# EAGLE design AQILITY (EAGLE 7.1.0)
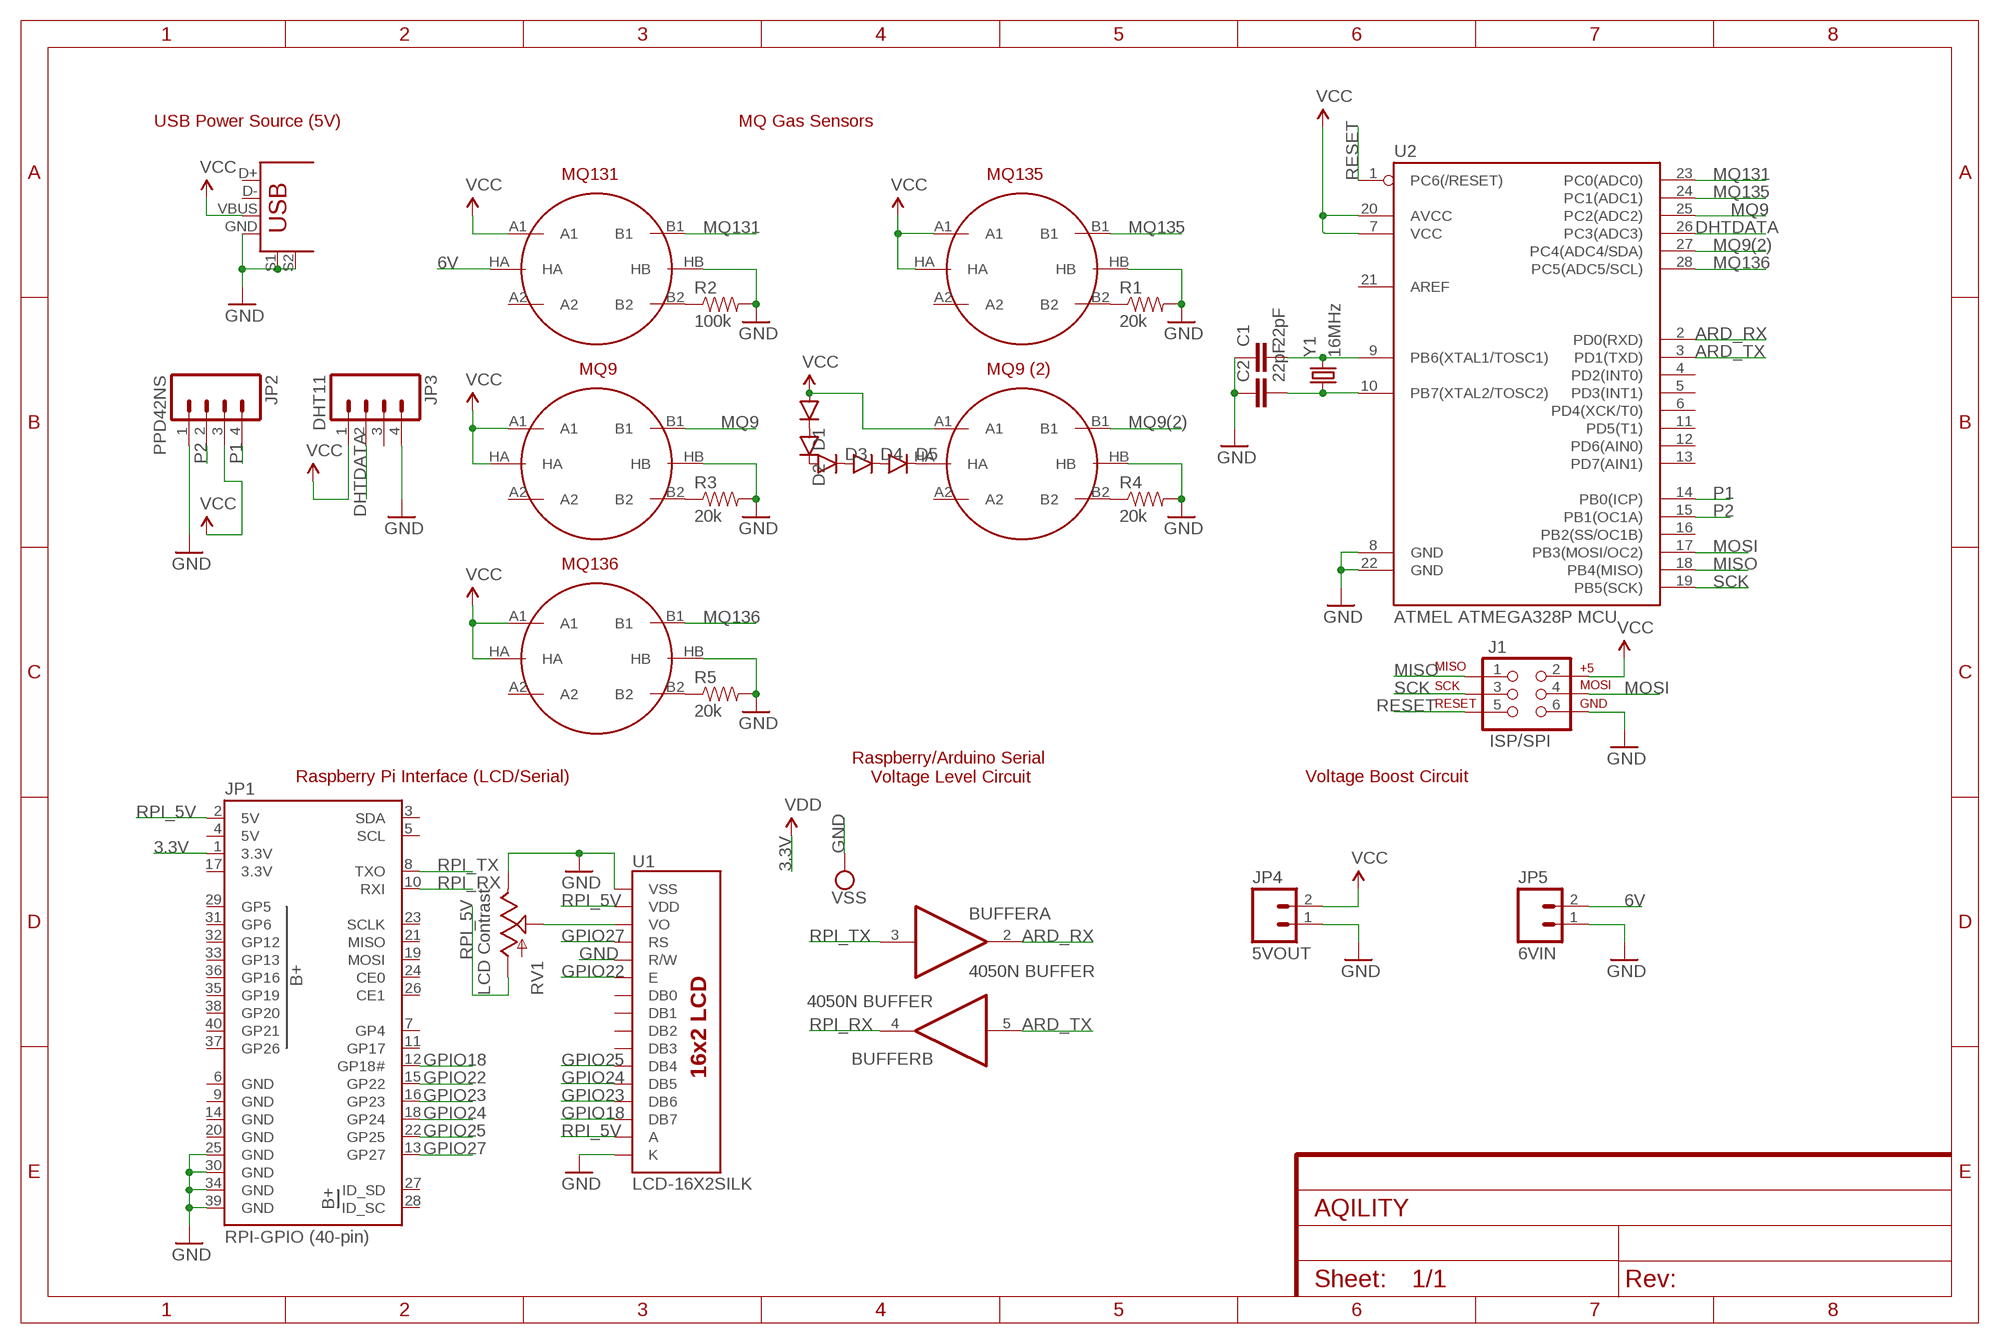
[diagram p0: schematic, sheet 1]

## Parts
BUFFER  4050N BUFFER  4050N  [DIL16]
C1  22pF  CAPEZ  [CAP-PTH-SMALLEZ]
C2  22pF  CAPEZ  [CAP-PTH-SMALLEZ]
D1  DIODEKIT2  [DIODE-1N4001-KIT]
D2  DIODEKIT2  [DIODE-1N4001-KIT]
D3  DIODEKIT2  [DIODE-1N4001-KIT]
D4  DIODEKIT2  [DIODE-1N4001-KIT]
D5  DIODEKIT2  [DIODE-1N4001-KIT]
J1  ISP/SPI  AVR_SPI_PRG_6PTH  [2X3]
JP1  RPI-GPIO (40-pin)  RASPBERRYPI-B+-GPIO  [2X20-SHROUDED]
JP2  PPD42NS  M04PTH  [1X04]
JP3  DHT11  M04PTH  [1X04]
JP4  5VOUT  M02PTH  [1X02]
JP5  6VIN  M02PTH  [1X02]
MQ9  METHANE_SENSOR  [MQ-3]
MQ9(2)  METHANE_SENSOR  [MQ-3]
MQ131  METHANE_SENSOR  [MQ-3]
MQ135  METHANE_SENSOR  [MQ-3]
MQ136  METHANE_SENSOR  [MQ-3]
R1  20k  RESISTORPTH-1/4W  [AXIAL-0.4]
R2  100k  RESISTORPTH-1/4W  [AXIAL-0.4]
R3  20k  RESISTORPTH-1/4W  [AXIAL-0.4]
R4  20k  RESISTORPTH-1/4W  [AXIAL-0.4]
R5  20k  RESISTORPTH-1/4W  [AXIAL-0.4]
RV1  LCD Contrast  POT100K_3362U  [3362U]
U1  LCD-16X2SILK  [LCD-16X2]
U2  ATMEL ATMEGA328P MCU  ATMEGA328P_PDIP  [DIL28-3]
U$5  USB/5V  USB+SHIELD  [USB-B-PTH]
Y1  16MHz  CRYSTALHC49UV  [HC49U-V]

## Nets
3.3V: JP1.1(3.3V) ; supply symbol labelled VDD
6V: JP5.2 MQ131.HA
ARD_RX: BUFFER.2(A:O) U2.2(PD0(RXD))
ARD_TX: BUFFER.5(B:I) U2.3(PD1(TXD))
DHTDATA: JP3.2 U2.26(PC3(ADC3))
GND: C1.1 C2.1 J1.6 JP1.25(GND) JP1.30(GND) JP1.34(GND) JP1.39(GND) JP2.1 JP3.4 JP4.1 JP5.1 MQ9(2).HB MQ9.HB MQ131.HB MQ135.HB MQ136.HB R1.P$2 R2.P$2 R3.P$2 R4.P$2 R5.P$2 RV1.P$1(E) U1.1(VSS) U1.5(R/W) U1.16(K) U2.8(GND) U2.22(GND) U$5.GND U$5.S1 U$5.S2 ; supply symbol labelled VSS
GPIO18: JP1.12(GP18#) U1.14(DB7)
GPIO22: JP1.15(GP22) U1.6(E)
GPIO23: JP1.16(GP23) U1.13(DB6)
GPIO24: JP1.18(GP24) U1.12(DB5)
GPIO25: JP1.22(GP25) U1.11(DB4)
GPIO27: JP1.13(GP27) U1.4(RS)
MISO: J1.1 U2.18(PB4(MISO))
MOSI: J1.4 U2.17(PB3(MOSI/OC2))
MQ9: MQ9.B1 U2.25(PC2(ADC2))
MQ9(2): MQ9(2).B1 U2.27(PC4(ADC4/SDA))
MQ131: MQ131.B1 U2.23(PC0(ADC0))
MQ135: MQ135.B1 U2.24(PC1(ADC1))
MQ136: MQ136.B1 U2.28(PC5(ADC5/SCL))
N$1: RV1.P$2(S) U1.3(VO)
N$2: C1.2 U2.9(PB6(XTAL1/TOSC1)) Y1.2
N$3: C2.2 U2.10(PB7(XTAL2/TOSC2)) Y1.1
N$4: D1.C D2.A
N$5: D2.C D3.A
N$6: D3.C D4.A
N$7: D5.C MQ9(2).HA
N$8: D4.C D5.A
N$9: MQ136.B2 R5.P$1
N$10: MQ135.B2 R1.P$1
N$11: MQ9.B2 R3.P$1
N$14: MQ131.B2 R2.P$1
N$15: MQ9(2).B2 R4.P$1
P1: JP2.4 U2.14(PB0(ICP))
P2: JP2.2 U2.15(PB1(OC1A))
RESET: J1.5 U2.1(PC6(/RESET))
RPI_5V: JP1.2(5V) RV1.P$3(A) U1.2(VDD) U1.15(A)
RPI_RX: BUFFER.4(B:O) JP1.10(RXI)
RPI_TX: BUFFER.3(A:I) JP1.8(TXO)
SCK: J1.3 U2.19(PB5(SCK))
VCC: D1.A J1.2 JP2.3 JP3.1 JP4.2 MQ9(2).A1 MQ9.A1 MQ9.HA MQ131.A1 MQ135.A1 MQ135.HA MQ136.A1 MQ136.HA U2.7(VCC) U2.20(AVCC) U$5.VBUS
Unconnected: BUFFER.6(C:O) BUFFER.7(C:I) BUFFER.9(D:I) BUFFER.10(D:O) BUFFER.11(E:I) BUFFER.12(E:O) BUFFER.14(F:I) BUFFER.15(F:O) JP1.3(SDA) JP1.5(SCL) JP1.7(GP4) JP1.11(GP17) JP1.19(MOSI) JP1.21(MISO) JP1.23(SCLK) JP1.24(CE0) JP1.26(CE1) JP1.27(ID_SD) JP1.28(ID_SC) JP1.29(GP5) JP1.31(GP6) JP1.32(GP12) JP1.33(GP13) JP1.35(GP19) JP1.36(GP16) JP1.37(GP26) JP1.38(GP20) JP1.40(GP21) JP3.3 MQ9(2).A2 MQ9.A2 MQ131.A2 MQ135.A2 MQ136.A2 U1.7(DB0) U1.8(DB1) U1.9(DB2) U1.10(DB3) U2.4(PD2(INT0)) U2.5(PD3(INT1)) U2.6(PD4(XCK/T0)) U2.11(PD5(T1)) U2.12(PD6(AIN0)) U2.13(PD7(AIN1)) U2.16(PB2(SS/OC1B)) U2.21(AREF) U$5.D+ U$5.D-

## Notes on the sheet
- USB Power Source (5V) | MQ Gas Sensors
- MQ131 | MQ135
- MQ9 | MQ9 (2)
- MQ136
- Raspberry Pi Interface (LCD/Serial)
- Raspberry/Arduino Serial 
  Voltage Level Circuit
- Voltage Boost Circuit

## Power pins joined to a net without a drawn wire
3.3V: BUFFER.1(P:VDD) JP1.17(3.3V)
5V: JP1.4(5V)
GND: BUFFER.8(P:VSS) JP1.6(GND) JP1.9(GND) JP1.14(GND) JP1.20(GND)

## Library data of the parts
BUFFER = 40xx:4050: Hex non-inverting BUFFER
C1 C2 = SparkFun-Capacitors:CAP: Capacitor Standard 0603 ceramic capacitor, and 0.1" leaded capacitor.
D1-D5 = SparkFun-DiscreteSemi:DIODE: Diode These are standard reverse protection diodes and small signal diodes. SMA package can handle up to about 1A. SOD-323 can handle about 200mA. What the SOD-323 package when ordering, there are some mfgs out there that are 5-pin packages.
J1 = SparkFun-Connectors:AVR_SPI_PRG_6: AVR ISP 6 Pin This is the reduced ISP connector for AVR programming. Common on Arduino. This footprint will take up less PCB space and can be used with a 10-pin to 6-pin adapter such as SKU: BOB-08508 **Special note about "TEST_POINT" package. The stop mask is on the top side, so if you want your programming test points to be on the bottom of your board, make sure to place this package on the bottom side of the board. This also ensure that the orientation to program from the bottom side will be correct.
JP1 = SparkFun-Boards:RASPBERRYPI-B+-GPIO: Raspberry Pi B+ GPIO Header 2x20 pin connector
JP2 JP3 = SparkFun-Connectors:M04: Header 4 Standard 4-pin 0.1" header. Use with straight break away headers (SKU : PRT-00116), right angle break away headers (PRT-00553), swiss pins (PRT-00743), machine pins (PRT-00117), and female headers (PRT-00115). Molex polarized connector foot print use with SKU : PRT-08231 with associated crimp pins and housings. 1MM SMD Version SKU: PRT-10208
JP4 JP5 = SparkFun-Connectors:M02: Standard 2-pin 0.1" header. Use with - straight break away headers ( PRT-00116) - right angle break away headers (PRT-00553) - swiss pins (PRT-00743) - machine pins (PRT-00117) - female headers (PRT-00115) Molex polarized connector foot print use with: PRT-08233 with associated crimp pins and housings. 2.54_SCREWTERM for use with PRT-10571. 3.5mm Screw Terminal footprints for PRT-08084 5mm Screw Terminal footprints for use with PRT-08432
MQ9 MQ9(2) MQ131 MQ135 MQ136 = SparkFun-Sensors:METHANE_SENSOR: MQ-4 Methane Gas Sensor SEN-09404
R1-R5 = SparkFun-Passives:RESISTOR: Resistor Basic schematic elements and footprints for 0603, 1206, and PTH resistors.
RV1 = SparkFun-Electromechanical:POT
U1 = SparkFun-Displays:LCD-16X2: Standard text-only 16x2 parallel input LCD
U2 = SparkFun-DigitalIC:ATMEGA328P_PDIP: uC used in the Arduino 32kb flash, 1k EEPROM, 2k SRAM This is the through-hole version of this chip.
U$5 = SparkFun-Connectors:USB+SHIELD: USB+Shield USB connector with shield pins connectable
Y1 = SparkFun-FreqCtrl:CRYSTAL: Various standard crystals. Proven footprints.

## Board
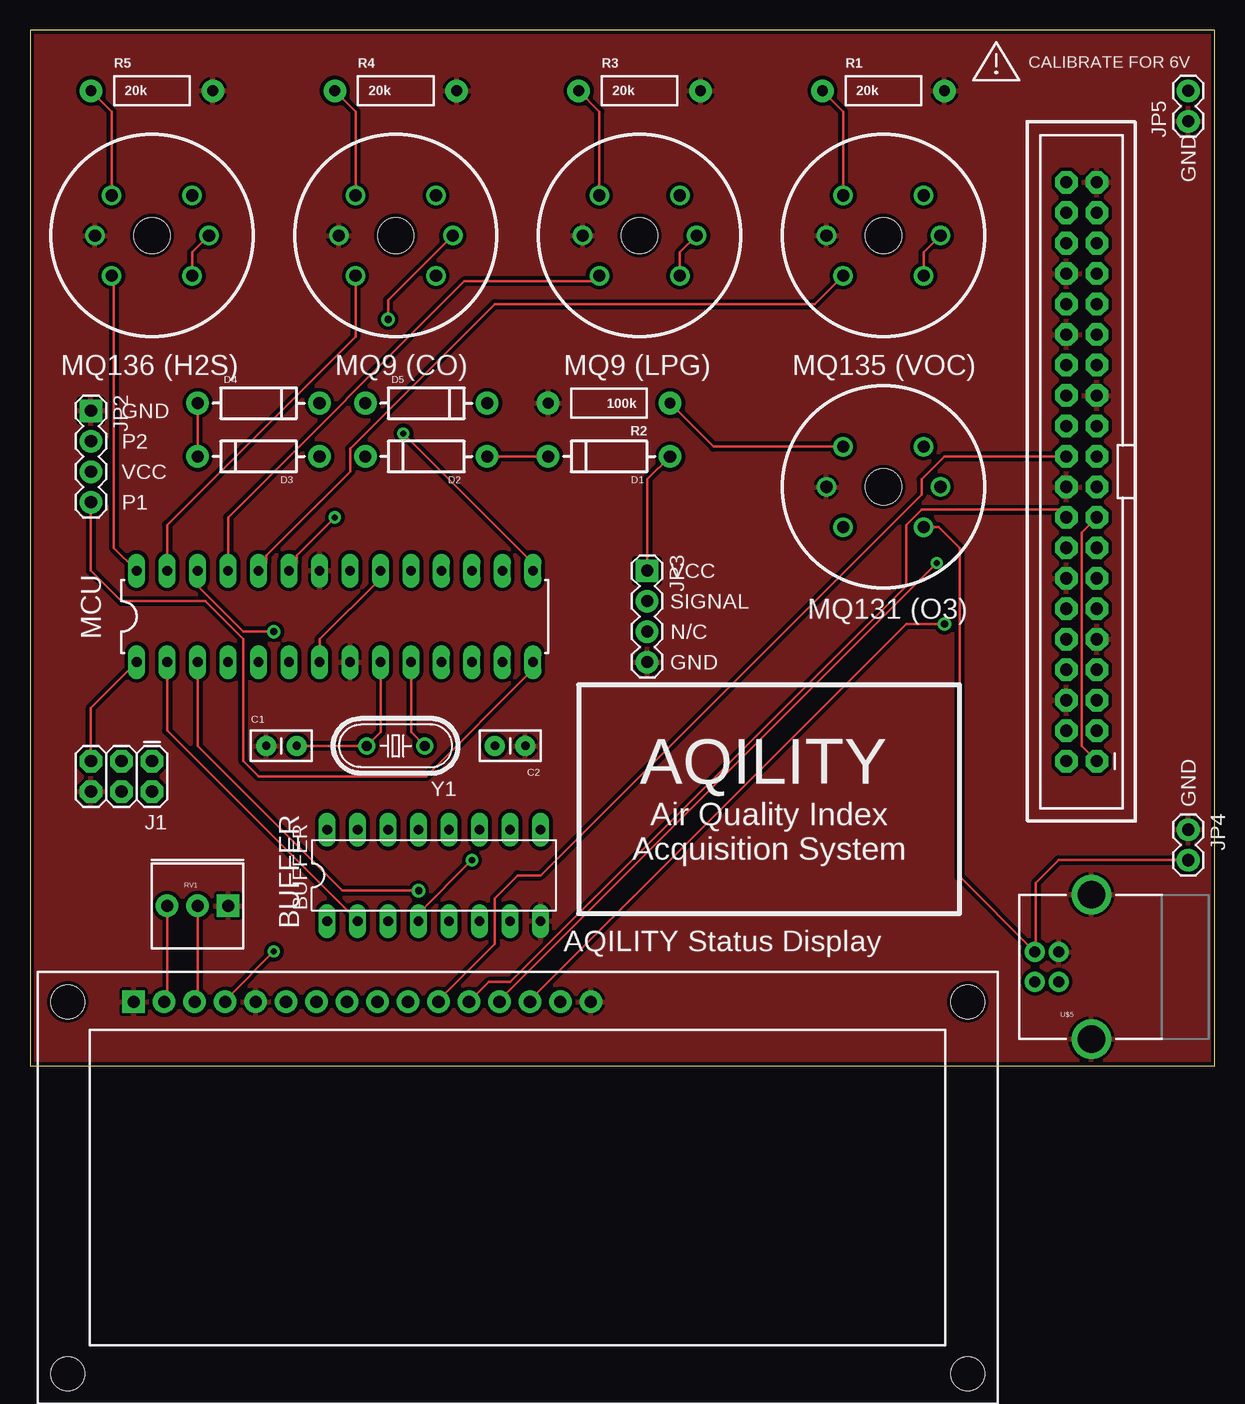
[diagram p1: board, top side]
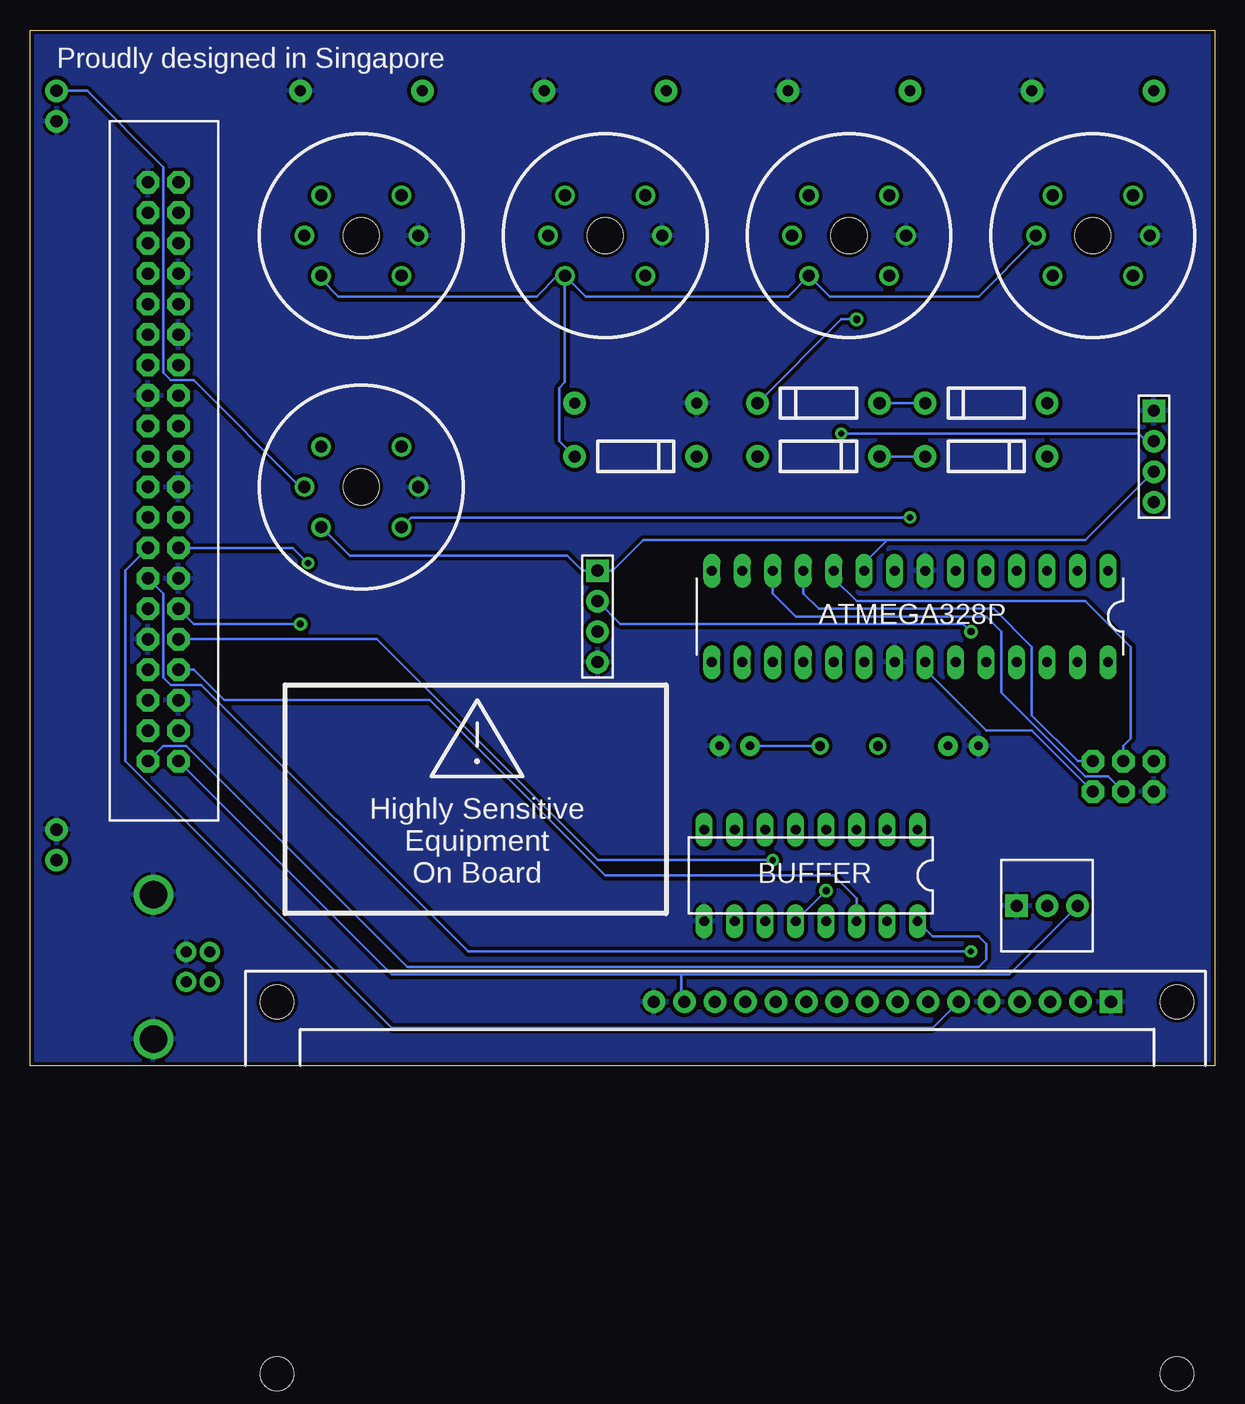
[diagram p2: board, bottom side, seen from below]

Size 98.73 x 86.35 mm. Coordinates in mm from the lower left corner, seen from the top.
Outline: 0,0 98.73,0 98.73,86.35 0,86.35 0,0
Copper layers (1*16): Top 0.035mm / dielectric 1.5mm / Bottom 0.035mm
Design rules "SparkFun": minimum track width 8mil, minimum drill 20mil, track to track 8mil, track to pad 8mil, pad to pad 8mil, via to via 8mil, smd to smd 8mil, copper to edge 10mil, drill to drill 8mil, minimum pad ring 12mil, minimum via ring 10mil, stop-mask expansion 4mil, vias tented up to drill 25mil, thermal gap 10mil

### Footprints (pad centres in the part's own frame; a part is rotated, then mirrored left to right if it is on the bottom)
DIL16 = drill 0.813 long: 1 -8.89,-3.81; 2 -6.35,-3.81; 3 -3.81,-3.81; 4 -1.27,-3.81; 5 1.27,-3.81; 6 3.81,-3.81; 7 6.35,-3.81; 8 8.89,-3.81; 9 8.89,3.81; 10 6.35,3.81; 11 3.81,3.81; 12 1.27,3.81; 13 -1.27,3.81; 14 -3.81,3.81; 15 -6.35,3.81; 16 -8.89,3.81
CAP-PTH-SMALLEZ = drill 0.7 pad 1.651: 1 0,0; 2 2.54,0
DIODE-1N4001-KIT = drill 1.016 pad 1.88: A -5.08,0; C 5.08,0
2X3 = drill 1.016 pad 1.88 octagon: 1 0,0; 2 0,2.54; 3 2.54,0; 4 2.54,2.54; 5 5.08,0; 6 5.08,2.54
2X20-SHROUDED = drill 1.016 pad 1.88 octagon: 1 -1.27,24.13; 2 1.27,24.13; 3 -1.27,21.59; 4 1.27,21.59; 5 -1.27,19.05; 6 1.27,19.05; 7 -1.27,16.51; 8 1.27,16.51; 9 -1.27,13.97; 10 1.27,13.97; 11 -1.27,11.43; 12 1.27,11.43; 13 -1.27,8.89; 14 1.27,8.89; 15 -1.27,6.35; 16 1.27,6.35; 17 -1.27,3.81; 18 1.27,3.81; 19 -1.27,1.27; 20 1.27,1.27; 21 -1.27,-1.27; 22 1.27,-1.27; 23 -1.27,-3.81; 24 1.27,-3.81; 25 -1.27,-6.35; 26 1.27,-6.35; 27 -1.27,-8.89; 28 1.27,-8.89; 29 -1.27,-11.43; 30 1.27,-11.43; 31 -1.27,-13.97; 32 1.27,-13.97; 33 -1.27,-16.51; 34 1.27,-16.51; 35 -1.27,-19.05; 36 1.27,-19.05; 37 -1.27,-21.59; 38 1.27,-21.59; 39 -1.27,-24.13; 40 1.27,-24.13
1X04 = drill 1.016 pad 1.88 square: 1 0,0 | drill 1.016 pad 1.88: 2 2.54,0; 3 5.08,0; 4 7.62,0
1X02 = drill 1.016 pad 1.88: 1 0,0; 2 2.54,0
MQ-3 = drill 1.016: A1 -3.35,3.35; A2 -3.35,-3.35; B1 3.35,3.35; B2 3.35,-3.35; HA -4.75,0; HB 4.75,0 | hole 3: 0,0
AXIAL-0.4 = drill 0.9 pad 1.88: P$1 -5.08,0; P$2 5.08,0
3362U = drill 1.016 pad 1.88 square: P$1 0,2.54 | drill 1.016 pad 1.88: P$2 2.54,2.54; P$3 5.08,2.54
LCD-16X2 = drill 1.016 pad 1.88 square: 1 -32,15.5 | drill 1.016 pad 1.88: 2 -29.46,15.5; 3 -26.92,15.5; 4 -24.38,15.5; 5 -21.84,15.5; 6 -19.3,15.5; 7 -16.76,15.5; 8 -14.22,15.5; 9 -11.68,15.5; 10 -9.14,15.5; 11 -6.6,15.5; 12 -4.06,15.5; 13 -1.52,15.5; 14 1.02,15.5; 15 3.56,15.5; 16 6.1,15.5 | hole 2.8: -37.5,15.5; -37.5,-15.5; 37.5,15.5; 37.5,-15.5
DIL28-3 = drill 0.813 long: 1 -16.51,-3.81; 2 -13.97,-3.81; 3 -11.43,-3.81; 4 -8.89,-3.81; 5 -6.35,-3.81; 6 -3.81,-3.81; 7 -1.27,-3.81; 8 1.27,-3.81; 9 3.81,-3.81; 10 6.35,-3.81; 11 8.89,-3.81; 12 11.43,-3.81; 13 13.97,-3.81; 14 16.51,-3.81; 15 16.51,3.81; 16 13.97,3.81; 17 11.43,3.81; 18 8.89,3.81; 19 6.35,3.81; 20 3.81,3.81; 21 1.27,3.81; 22 -1.27,3.81; 23 -3.81,3.81; 24 -6.35,3.81; 25 -8.89,3.81; 26 -11.43,3.81; 27 -13.97,3.81; 28 -16.51,3.81
USB-B-PTH = drill 0.914 pad 1.676: D+ 0,1.25; D- 1.981,1.25; GND 0,-1.25; VBUS 1.981,-1.25 | drill 2.286: S1 -2.718,-6.02; S2 -2.718,6.02
HC49U-V = drill 0.813: 1 -2.413,0; 2 2.413,0

### Placement (x,y rotation side)
BUFFER  33.66,15.88 0 top
C1  19.68,26.67 0 top
C2  41.27,26.67 180 top
D1  48.26,50.8 180 top
D2  33.02,50.8 180 top
D3  19.05,50.8 180 top
D4  19.05,55.24 0 top
D5  33.02,55.24 0 top
J1  10.16,25.4 180 top
JP1  87.63,49.53 180 top
JP2  5.08,54.61 270 top
JP3  51.44,41.27 270 top
JP4  96.52,19.68 270 top
JP5  96.52,78.74 90 top
MQ9  50.8,69.22 180 top
MQ9(2)  30.48,69.22 180 top
MQ131  71.12,48.26 180 top
MQ135  71.12,69.22 180 top
MQ136  10.16,69.22 180 top
R1  71.12,81.28 0 top
R2  48.26,55.24 180 top
R3  50.8,81.28 0 top
R4  30.48,81.28 0 top
R5  10.16,81.28 0 top
RV1  16.51,15.88 180 top
U1  40.64,-10.16 0 top
U2  25.4,37.47 0 top
U$5  85.72,8.26 180 top
Y1  30.48,26.67 180 top

### Tracks (layer width: path | path; a pad name or v marks a point on that pad's centre or on a via)
3.3V
  Top 0.203: JP1.17 87.63,44.45 87.63,26.67 JP1.1
  Bottom 0.203: JP1.1 87.63,26.67 85.72,26.67 67.31,8.26 19.68,8.26 19.05,8.89 19.05,10.16 19.68,10.79 23.5,10.79 BUFFER.1
6V
  Bottom 0.203: MQ131.HA 76.2,48.26 85.09,57.15 87,57.15 87.63,57.78 87.63,74.93 93.98,81.28 JP5.2
ARD_RX
  Top 0.203: U2.2 11.43,27.94 BUFFER.2
ARD_TX  (via drill 0.6)
  Top 0.203: U2.3 13.97,26.67 26.04,14.61 v32.38,14.61
  Bottom 0.203: v32.38,14.61 BUFFER.5
DHTDATA  (via drill 0.6)
  Top 0.203: v20.32,36.2 17.78,36.2 13.97,40.01 U2.26
  Bottom 0.203: JP3.2 49.53,36.83 20.95,36.83 v20.32,36.2
GND
  pour Bottom (isolate 0.305): 0,0 99.06,0 99.06,86.36 0,86.36
  pour Top (isolate 0.305): 0,0 99.06,0 99.06,86.36 0,86.36
GPIO18  (via drill 0.6)
  Top 0.203: U1.14 41.91,5.71 73.03,36.83 v76.2,36.83
  Bottom 0.203: v76.2,36.83 85.09,36.83 JP1.12
GPIO22
  Bottom 0.203: U1.6 21.59,5.08 23.5,3.17 68.58,3.17 90.81,25.4 90.81,41.27 JP1.15
GPIO23  (via drill 0.51)
  Top 0.203: v75.56,41.91 39.37,5.71 U1.13
  Bottom 0.203: v75.56,41.91 76.83,43.18 JP1.16
GPIO24
  Top 0.203: U1.12 38.23,6.99 40.01,6.99 73.03,40.01 73.03,45.09 74.3,46.35 85.72,46.35 JP1.18
GPIO25
  Top 0.203: JP1.22 76.2,50.8 74.3,48.9 74.3,47.62 42.55,15.88 40.64,15.88 38.73,13.97 38.73,10.16 34.29,5.71 U1.11
GPIO27  (via drill 0.51)
  Top 0.203: v20.32,9.53 16.51,5.71 U1.4
  Bottom 0.203: v20.32,9.53 62.23,9.53 84.45,31.75 87,31.75 87.63,32.38 87.63,39.37 JP1.13
MISO
  Bottom 0.203: J1.1 11.43,25.4 15.24,29.21 15.24,34.92 18.41,38.1 33.02,38.1 34.29,39.37 U2.18
MOSI
  Bottom 0.203: J1.4 8.89,24.13 10.79,24.13 17.78,31.11 17.78,36.2 19.05,37.47 34.92,37.47 36.83,39.37 U2.17
MQ9
  Top 0.203: U2.25 16.51,45.72 36.2,65.41 46.99,65.41 MQ9.B1
MQ9(2)
  Top 0.203: U2.27 11.43,45.09 27.13,60.78 MQ9(2).B1
MQ131  (via drill 0.51)
  Top 0.203: U2.23 22.23,41.91 22.23,42.55 v25.4,45.72
  Bottom 0.203: v25.4,45.72 66.96,45.72 MQ131.B1
MQ135
  Top 0.203: U2.24 19.68,41.91 19.68,42.55 26.67,49.53 26.67,51.44 38.73,63.5 65.41,63.5 MQ135.B1
MQ136
  Top 0.203: MQ136.B1 6.81,65.58 6.99,65.41 6.99,43.18 U2.28
N$1
  Top 0.203: RV1.P$2 13.97,5.71 U1.3
N$2
  Top 0.203: U2.9 29.21,27.81 Y1.2 C1.2
N$3
  Top 0.203: U2.10 31.75,27.81 Y1.1
  Bottom 0.203: Y1.1 C2.2
N$4
  Top 0.203: D1.C D2.A
N$5
  Bottom 0.203: D2.C D3.A
N$6
  Top 0.203: D3.C D4.A
N$7  (via drill 0.6)
  Top 0.203: v29.84,62.23 29.84,63.83 MQ9(2).HA
  Bottom 0.203: D5.C 31.11,62.23 v29.84,62.23
N$8
  Bottom 0.203: D4.C D5.A
N$9
  Top 0.203: MQ136.B2 6.81,79.55 R5.P$1
N$10
  Top 0.203: MQ135.B2 67.77,79.55 R1.P$1
N$11
  Top 0.203: MQ9.B2 47.45,79.55 R3.P$1
N$14
  Top 0.203: MQ131.B2 56.98,51.61 R2.P$1
N$15
  Top 0.203: MQ9(2).B2 27.13,79.55 R4.P$1
P1
  Top 0.203: JP2.4 5.08,41.27 7.62,38.73 14.61,38.73 17.78,35.56 17.78,25.4 19.05,24.13 33.02,24.13 41.91,33.02 U2.14
P2  (via drill 0.51)
  Top 0.203: v31.11,52.7 41.91,41.91 U2.15
  Bottom 0.203: v31.11,52.7 6.35,52.7 5.71,52.07 JP2.2
RESET
  Top 0.203: J1.5 5.08,29.84 U2.1
RPI_5V
  Top 0.203: RV1.P$3 11.43,5.71 U1.2
  Bottom 0.203: 44.45,7.62 17.14,7.62 RV1.P$3 | 44.45,7.62 68.58,7.62 JP1.2 | 44.45,7.62 44.45,5.59 U1.15
RPI_RX  (via drill 0.51)
  Top 0.203: BUFFER.4 32.38,12.7 v36.83,17.14
  Bottom 0.203: v36.83,17.14 51.44,17.14 69.85,35.56 JP1.10
RPI_TX
  Bottom 0.203: JP1.8 85.09,33.02 82.55,30.48 65.41,30.48 50.8,15.88 31.75,15.88 29.84,13.97 BUFFER.3
SCK
  Bottom 0.203: U2.19 31.75,40.64 29.84,38.73 10.79,38.73 6.99,34.92 6.99,27.3 7.62,26.67 J1.3
VCC
  Top 0.203: U2.7 24.13,35.56 29.21,40.64 U2.20 | MQ9.A1 54.15,67.81 MQ9.HA | MQ135.A1 74.47,67.81 MQ135.HA | MQ131.A1 75.74,44.91 77.47,43.18 77.47,15.78 U$5.VBUS 83.82,9.58 83.82,15.24 85.72,17.14 JP4.2 | MQ136.A1 13.51,67.81 MQ136.HA | D1.A 51.44,48.9 JP3.1
  Bottom 0.203: JP2.3 10.79,43.81 27.3,43.81 | 27.3,43.81 29.21,41.91 U2.20 | J1.2 15.24,27.94 19.05,27.94 24.13,33.02 U2.7 | 27.3,43.81 47.62,43.81 50.16,41.27 JP3.1 52.7,41.27 53.98,42.55 72.11,42.55 MQ131.A1 | MQ9.A1 54.78,65.86 56.52,64.14 73.03,64.14 74.47,65.58 MQ135.A1 | MQ136.HA 14.91,68.91 19.68,64.14 32.1,64.14 MQ9(2).A1 35.56,64.14 52.42,64.14 MQ9.A1 | MQ9.A1 54.15,56.98 54.61,56.52 54.61,52.07 D1.A

### Text on the board
tPlace: CALIBRATE FOR 6V | GND | MQ136 (H2S) | MQ9 (CO) | MQ9 (LPG) | MQ135 (VOC) | GND | P2 | VCC | P1 | VCC | SIGNAL | MQ131 (O3) | MCU | N/C | GND | AQILITY | GND | Air Quality Index / Acquisition System | BUFFER | AQILITY Status Display
bPlace: Proudly designed in Singapore | ATMEGA328P | BUFFER | Highly Sensitive / Equipment / On Board